# Altium project PCB_15122020_01CA.PrjPcb (part 5 of 7)
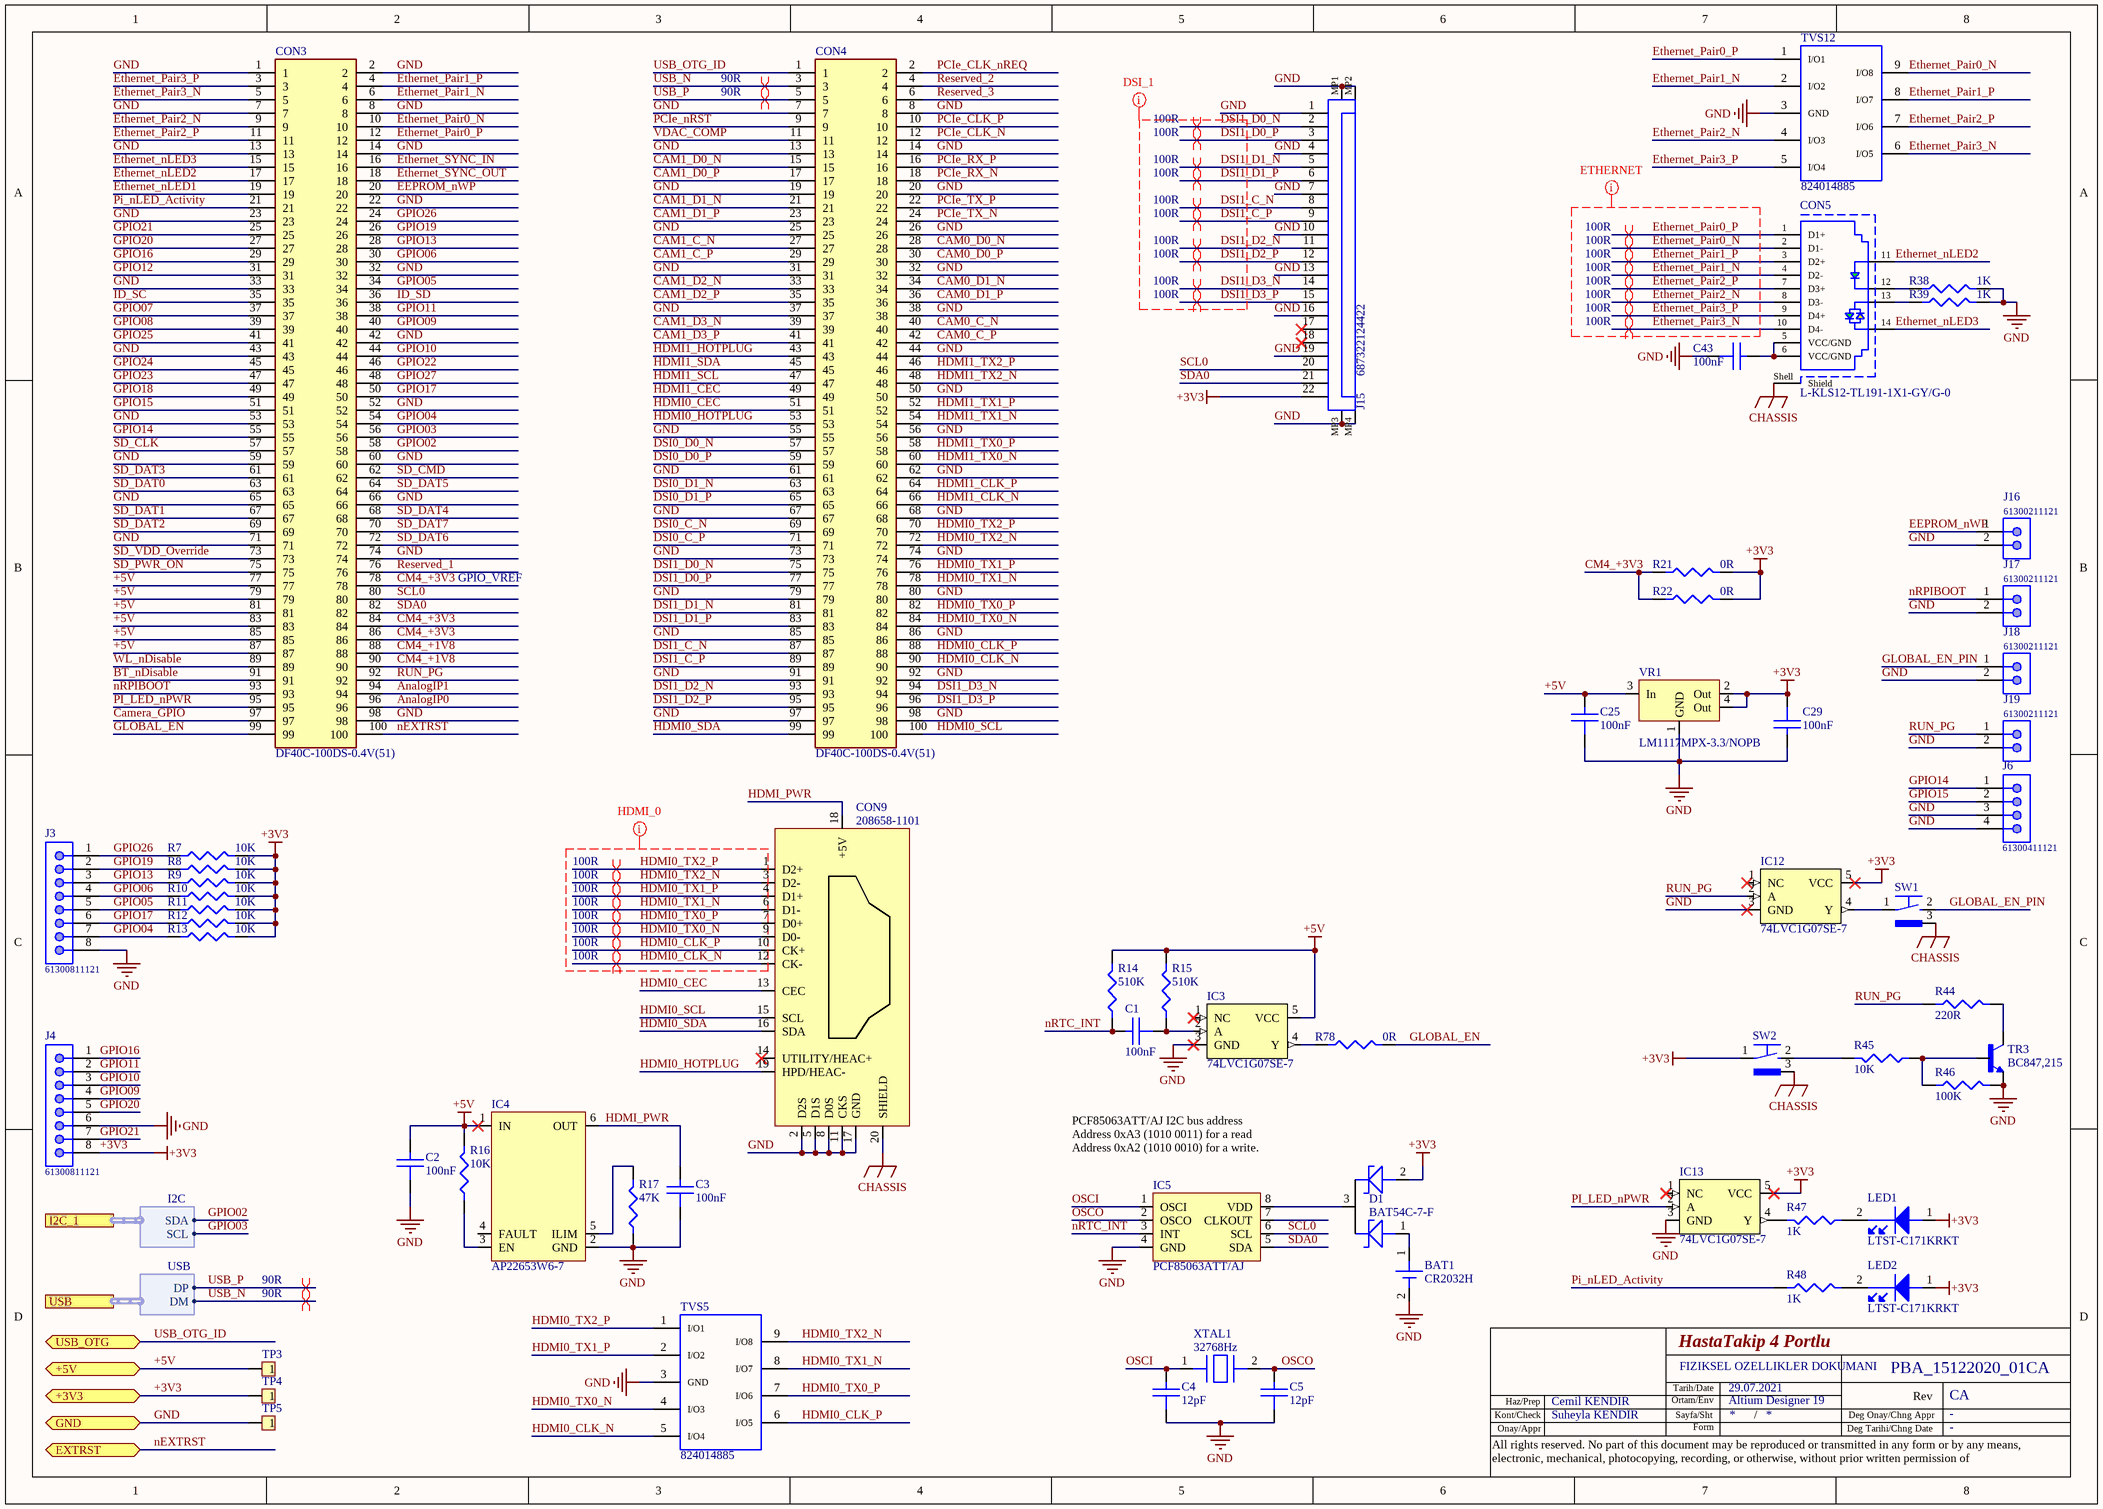
[diagram p9: RaspberyConnector.SchDoc]

## Sheet RaspberyConnector.SchDoc (continued)

### Library data of the parts
BAT1 = CR2032H: CR2032 Yatay Montaj; Category: Battery
C1-C3 C25 C29 C43 = CC0603KRX7R8BB104: 100nF, 25V, X7R, 10%, 0603; Manufacturer: Yageo; Supplier 1: Digi-Key; Supplier Part Number 1: 311-1341-1-ND; Manufacturer Part Number: CC0603KRX7R8BB104; Stock 1: 10150433; Pricing 1: 1 = 0,10000, 10 = 0,04500, 50 = 0,02480, 100 = 0,02020, 500 = 0,01444, 1000 = 0,01134 (USD); RoHS: Yes; Mount: Surface Mount; Case/Package: 0603; Number of Pins: 2; Case Code (Imperial): 0603; Case Code (Metric): 1608; Min Operating Temperature: -55°C; Max Operating Temperature: 125°C; Capacitance: 100nF; Tolerance: 10%; Voltage Rating: 25V; Packaging: Tape and Reel; Package Quantity: 1; Voltage Rating (DC): 25V; Dielectric: X7R; Termination: SMD/SMT; Resistor Type: Ceramic; Voltage: 25V; Length: 1.6mm; Width: 0.8mm; Height: 0.8mm; Thickness: 0.035inch; Depth: 0.8mm; Radiation Hardening: No; REACH SVHC: Unknown; Lead Free: Lead Free; Halogen Free: Halogen Free; ComponentLink1URL: https://datasheet.ciiva.com/11786/0900766b80c10176-11786120.pdf?src-supplier=RSComponents; ComponentLink1Description: https://datasheet.ciiva.com/11786/0900766b80c10176-11786120.pdf?src-supplier=RSComponents; ComponentLink2URL: https://datasheet.ciiva.com/144/mlccorderingcode-144075.pdf?src-supplier=Digi-Key; ComponentLink2Description: https://datasheet.ciiva.com/144/mlccorderingcode-144075.pdf?src-supplier=Digi-Key; ComponentLink3URL: https://datasheet.ciiva.com/17434/upy-gphc-x7r-6-3v-to-50v-8-17434263.pdf?src-supplier=Avnet+Europe; ComponentLink3Description: https://datasheet.ciiva.com/17434/upy-gphc-x7r-6-3v-to-50v-8-17434263.pdf?src-supplier=Avnet+Europe; ComponentLink4URL: https://datasheet.ciiva.com/26829/getdatasheetpartid-403577-26829431.pdf?src-supplier=Verical; ComponentLink4Description: https://datasheet.ciiva.com/26829/getdatasheetpartid-403577-26829431.pdf?src-supplier=Verical; ComponentLink5URL: https://datasheet.ciiva.com/11587/upy-gphc-x7r-6-3v-to-50v-8-11587208.pdf?src-supplier=Avnet; ComponentLink5Description: https://datasheet.ciiva.com/11587/upy-gphc-x7r-6-3v-to-50v-8-11587208.pdf?src-supplier=Avnet; ComponentLink6URL: https://datasheet.ciiva.com/13389/upy-gphc-x7r-6-3v-to-50v-8-13389352.pdf?src-supplier=Mouser; ComponentLink6Description: https://datasheet.ciiva.com/13389/upy-gphc-x7r-6-3v-to-50v-8-13389352.pdf?src-supplier=Mouser; ComponentLink7URL: https://datasheet.ciiva.com/28450/1489800-28450584.pdf?src-supplier=Element14; ComponentLink7Description: https://datasheet.ciiva.com/28450/1489800-28450584.pdf?src-supplier=Element14; ComponentLink8URL: https://datasheet.ciiva.com/144/mlccorderingcode-144073.pdf?src-supplier=Digi-Key; ComponentLink8Description: https://datasheet.ciiva.com/144/mlccorderingcode-144073.pdf?src-supplier=Digi-Key; ComponentLink9URL: https://datasheet.ciiva.com/144/mlccorderingcode-144074.pdf?src-supplier=Digi-Key; ComponentLink9Description: https://datasheet.ciiva.com/144/mlccorderingcode-144074.pdf?src-supplier=Digi-Key; ComponentLink10URL: https://datasheet.ciiva.com/7978/1489800-7978155.pdf?src-supplier=Element14; ComponentLink10Description: https://datasheet.ciiva.com/7978/1489800-7978155.pdf?src-supplier=Element14; Category: Capasitor
C4 C5 = CC0603JRNPO9BN120: 12pF 50V C0G 5% SMD 0603 125C T/R; Manufacturer: Yageo; Dielectric Material: Ceramic; Insulation Resistance: 100GR; Supplier 1: Digi-Key; Supplier Part Number 1: 311-1059-1-ND; Manufacturer Part Number: CC0603JRNPO9BN120; Stock 1: 139479; Pricing 1: 1 = 0,10000, 10 = 0,05600, 50 = 0,03040, 100 = 0,02480, 500 = 0,01774, 1000 = 0,01395 (USD); RoHS: Yes; Mount: Surface Mount; Case/Package: 0603; Number of Pins: 2; Case Code (Metric): 1608; Case Code (Imperial): 0603; Min Operating Temperature: -55°C; Max Operating Temperature: 125°C; Capacitance: 12pF; Tolerance: 5%; Packaging: Tape and Reel; Voltage Rating (DC): 50V; Dielectric: C0G; Package Quantity: 1; Voltage Rating: 50V; Termination: SMD/SMT; Resistor Type: Ceramic; Length: 1.6mm; Width: 0.031inch; Height: 0.8mm; Thickness: 0.035inch; Depth: 0.8mm; Radiation Hardening: No; REACH SVHC: No SVHC; Lead Free: Lead Free; ComponentLink1URL: https://datasheet.ciiva.com/144/mlccorderingcode-144448.pdf?src-supplier=Digi-Key; ComponentLink1Description: https://datasheet.ciiva.com/144/mlccorderingcode-144448.pdf?src-supplier=Digi-Key; ComponentLink2URL: https://datasheet.ciiva.com/144/mlccorderingcode-144449.pdf?src-supplier=Digi-Key; ComponentLink2Description: https://datasheet.ciiva.com/144/mlccorderingcode-144449.pdf?src-supplier=Digi-Key; ComponentLink3URL: https://datasheet.ciiva.com/144/mlccorderingcode-144450.pdf?src-supplier=Digi-Key; ComponentLink3Description: https://datasheet.ciiva.com/144/mlccorderingcode-144450.pdf?src-supplier=Digi-Key; ComponentLink4URL: https://datasheet.ciiva.com/8033/1734582-8033717.pdf?src-supplier=Element14; ComponentLink4Description: https://datasheet.ciiva.com/8033/1734582-8033717.pdf?src-supplier=Element14; ComponentLink5URL: https://datasheet.ciiva.com/5425/upy-gp-np0-16v-to-50v-8-5425478.pdf?src-supplier=Mouser; ComponentLink5Description: https://datasheet.ciiva.com/5425/upy-gp-np0-16v-to-50v-8-5425478.pdf?src-supplier=Mouser; ComponentLink6URL: https://datasheet.ciiva.com/8033/1734582-8033718.pdf?src-supplier=Element14; ComponentLink6Description: https://datasheet.ciiva.com/8033/1734582-8033718.pdf?src-supplier=Element14; ComponentLink7URL: https://datasheet.ciiva.com/11464/upy-gp-np0-16v-to-50v-8-11464726.pdf?src-supplier=Avnet; ComponentLink7Description: https://datasheet.ciiva.com/11464/upy-gp-np0-16v-to-50v-8-11464726.pdf?src-supplier=Avnet; ComponentLink8URL: https://datasheet.ciiva.com/28450/1443161-28450470.pdf?src-supplier=Element14; ComponentLink8Description: https://datasheet.ciiva.com/28450/1443161-28450470.pdf?src-supplier=Element14; ComponentLink9URL: https://datasheet.ciiva.com/16625/upy-gp-np0-16v-to-50v-8-16625516.pdf?src-supplier=Avnet+Europe; ComponentLink9Description: https://datasheet.ciiva.com/16625/upy-gp-np0-16v-to-50v-8-16625516.pdf?src-supplier=Avnet+Europe; Category: Capasitor
CON3 CON4 = DF40C-100DS-0.4V(51): Manufacturer: Hirose; Connector Type: Receptacle; Number of Positions: 100; Max Voltage Rating (AC): 30V; Contact Resistance: 90mR; Max Current Rating: 300mA; Pitch: 0.4mm; Mated Stacking Heights: 1.5mm; Supplier 1: Digi-Key; Manufacturer Part Number: DF40C-100DS-0.4V(51); Stock 1: 4110; Pricing 1: 1 = 1,73000, 10 = 1,56800, 25 = 1,47200, 50 = 1,40800, 100 = 1,34400, 250 = 1,21600, 500 = 1,12000, 1000 = 0,96000, 2500 = 0,89600 (USD); RoHS: Yes; Mount: Surface Mount; Housing Material: Polymer; Housing Color: Black; Contact Material: Bronze; Contact Plating: Gold; Min Operating Temperature: -35°C; Max Operating Temperature: 85°C; Orientation: Straight; Termination: SMD/SMT; Number of Contacts: 100; Gender: Receptacle; Number of Rows: 2; Packaging: Tape and Reel; Package Quantity: 1; Voltage Rating: 30V; Current Rating: 300mA; Length: 22.6mm; Depth: 3.38mm; Radiation Hardening: No; Lead Free: Lead Free; REACH SVHC: Unknown; ComponentLink1URL: https://datasheet.ciiva.com/26948/getdatasheetpartid-441624-26948933.pdf?src-supplier=Verical; ComponentLink1Description: https://datasheet.ciiva.com/26948/getdatasheetpartid-441624-26948933.pdf?src-supplier=Verical; ComponentLink2URL: https://datasheet.ciiva.com/46408/1824826-46408894.pdf?src-supplier=Element14; ComponentLink2Description: https://datasheet.ciiva.com/46408/1824826-46408894.pdf?src-supplier=Element14; Supplier Part Number 1: H11615CT-ND; Category: Connectors, Interconnects Rectangular Connectors - Arrays, Edge Type, Mezzanine (Board to Board)
CON5 = L-KLS12-TL191-1X1-GY/G-0: MODULAR JACK THT R/A 8P8C (RJ45,Ethernet) GRAY; Manufacturer: KLS ELECTRONIC; Category: Connectors, Interconnects Modular Connectors - Jacks With Magnetics; Manufacturer Part Number: L-KLS12-TL191-1X1-GY/G-0; Supplier 1: Özdisan; Supplier Part Number 1: L-KLS12-TL191-1X1-GY/G-0; ComponentLink1Description: Ozdisan; ComponentLink1URL: https://cdn.ozdisan.com/ETicaret_Dosya/528004_2611611.PDF
CON9 = 208658-1101: HDMI; 0.5mm; v2.1; RT Angle; w/o Mylar; w/o Flange; 19 Circuits; Manufacturer: Molex; Supplier 1: Digi-Key; Supplier Part Number 1: 900-2086581101CT-ND; Manufacturer Part Number: 208658-1101; Stock 1: 1640; Pricing 1: 1 = 2,36000, 10 = 2,01000, 100 = 1,66040 (USD); RoHS: No; Category: Connectors, Interconnects HDMI Connectors
D1 = BAT54C-7-F: Diodes Inc BAT54C-7-F, Dual SMT Schottky Switching Diode, Common Cathode, 30V 200mA, 5ns, 3-Pin SOT-23; Power Rating: 200mW; Capacitance: 10pF; Forward Voltage: 800mV; Max Reverse Current: 2uA; Peak Non-Repetitive Surge Current: 600mA; Supplier 1: Digi-Key; Supplier Part Number 1: BAT54C-FDICT-ND; Manufacturer: Diodes; Manufacturer Part Number: BAT54C-7-F; Stock 1: 151567; Pricing 1: 1 = 0,18000, 10 = 0,13000, 100 = 0,07040, 500 = 0,05530, 1000 = 0,03840 (USD); RoHS: Yes; Mount: Surface Mount; Case/Package: SOT-23; Number of Pins: 3; Contact Plating: Tin,Matte; Weight: 0.000282oz; Min Operating Temperature: -65°C; Max Operating Temperature: 150°C; Current Rating: 200mA; Voltage Rating (DC): 30V; Package Quantity: 3000; Element Configuration: Common Cathode; Packaging: Tape and Reel; Forward Current: 200mA; Average Rectified Current: 200mA; Reverse Recovery Time: 5ns; Max Repetitive Reverse Voltage (Vrrm): 30V; Max Forward Surge Current (Ifsm): 600mA; Max Power Dissipation: 200mW; Power Dissipation: 200mW; Termination: SMD/SMT; Max Reverse Voltage (DC): 30V; Length: 2.9mm; Width: 1.3mm; Height: 1mm; Radiation Hardening: No; Lead Free: Lead Free; REACH SVHC: No SVHC; ComponentLink1URL: https://datasheet.ciiva.com/904/ds11005-904592.pdf?src-supplier=Digi-Key; ComponentLink1Description: https://datasheet.ciiva.com/904/ds11005-904592.pdf?src-supplier=Digi-Key; ComponentLink2URL: https://datasheet.ciiva.com/15143/getdatasheetpartid-29884-15143959.pdf?src-supplier=Verical; ComponentLink2Description: https://datasheet.ciiva.com/15143/getdatasheetpartid-29884-15143959.pdf?src-supplier=Verical; ComponentLink3URL: https://datasheet.ciiva.com/22695/1911820-22695254.pdf?src-supplier=Element14; ComponentLink3Description: https://datasheet.ciiva.com/22695/1911820-22695254.pdf?src-supplier=Element14; Category: Diode
IC3 IC12 IC13 = 74LVC1G07SE-7: Buffer/Driver 1-CH Non-Inverting Open Drain CMOS 5-Pin SOT-353 T/R; Manufacturer: Diodes; Number of Gates: 1; Max Supply Voltage: 5.5V; Min Supply Voltage: 1.65V; Propagation Delay: 8.5ns; Logic Function: Buffer,Inverting; Polarity: Inverting,Non-Inverting; Low Level Output Current: 32mA; Operating Supply Current: 10uA; Quiescent Current: 200uA; Supplier 1: Digi-Key; Supplier Part Number 1: 74LVC1G07SE-7DICT-ND; Manufacturer Part Number: 74LVC1G07SE-7; Stock 1: 16164; Pricing 1: 1 = 0,26000, 10 = 0,21500, 25 = 0,18000, 100 = 0,11400, 250 = 0,08800, 500 = 0,07500, 1000 = 0,05100 (USD); RoHS: Yes; Mount: Surface Mount; Case/Package: SOT-353; Number of Pins: 5; Min Operating Temperature: -40°C; Max Operating Temperature: 85°C; Number of Inputs: 1; Packaging: Tape and Reel; Package Quantity: 3000; Number of Elements: 1; Number of Channels: 1; Number of Outputs: 1; Number of Input Lines: 1; Number of Output Lines: 1; Number of Bits per Element: 1; Turn-On Delay Time: 8.5ns; Length: 2.2mm; Width: 1.35mm; Height: 1mm; Radiation Hardening: No; REACH SVHC: No SVHC; Lead Free: Lead Free; ComponentLink1URL: https://datasheet.ciiva.com/8260/74lvc1g07-8260976.pdf?src-supplier=Avnet; ComponentLink1Description: https://datasheet.ciiva.com/8260/74lvc1g07-8260976.pdf?src-supplier=Avnet; ComponentLink2URL: https://datasheet.ciiva.com/26856/getdatasheetpartid-302086-26856250.pdf?src-supplier=Verical; ComponentLink2Description: https://datasheet.ciiva.com/26856/getdatasheetpartid-302086-26856250.pdf?src-supplier=Verical; ComponentLink3URL: https://datasheet.ciiva.com/1832/74lvc1g07-1832566.pdf?src-supplier=Digi-Key; ComponentLink3Description: https://datasheet.ciiva.com/1832/74lvc1g07-1832566.pdf?src-supplier=Digi-Key; ComponentLink4URL: https://datasheet.ciiva.com/1832/74lvc1g07-1832567.pdf?src-supplier=Digi-Key; ComponentLink4Description: https://datasheet.ciiva.com/1832/74lvc1g07-1832567.pdf?src-supplier=Digi-Key; ComponentLink5URL: https://datasheet.ciiva.com/1832/74lvc1g07-1832568.pdf?src-supplier=Digi-Key; ComponentLink5Description: https://datasheet.ciiva.com/1832/74lvc1g07-1832568.pdf?src-supplier=Digi-Key; ComponentLink6URL: https://datasheet.ciiva.com/1506/74lvc1g07-1506202.pdf?src-supplier=Element14; ComponentLink6Description: https://datasheet.ciiva.com/1506/74lvc1g07-1506202.pdf?src-supplier=Element14; ComponentLink7URL: https://datasheet.ciiva.com/17291/74lvc1g07-17291948.pdf?src-supplier=Avnet+Europe; ComponentLink7Description: https://datasheet.ciiva.com/17291/74lvc1g07-17291948.pdf?src-supplier=Avnet+Europe; ComponentLink8URL: https://datasheet.ciiva.com/8305/74lvc1g07-8305775.pdf?src-supplier=Avnet; ComponentLink8Description: https://datasheet.ciiva.com/8305/74lvc1g07-8305775.pdf?src-supplier=Avnet; Category: Integrated Circuits (ICs) Logic - Buffers, Drivers, Receivers, Transceivers
IC4 = AP22653W6-7: Power Switch/Driver 1:1 P-Channel 2.1A SOT-23-6; Manufacturer: Diodes; Supplier 1: Digi-Key; Manufacturer Part Number: AP22653W6-7; Stock 1: 12659; Pricing 1: 1 = 0,42000, 10 = 0,35600, 25 = 0,33200, 100 = 0,24670, 250 = 0,20880, 500 = 0,19930, 1000 = 0,14710 (USD); RoHS: No; Supplier Part Number 1: 31-AP22653W6-7CT-ND; Category: Integrated Circuits - PMIC - Power Distribution Switches, Load Drivers
IC5 = PCF85063ATT/AJ: Real time clock, TSSOP-8,; Manufacturer: NXP Semiconductors; Interface: I2C,Serial,2-Wire; Max Supply Voltage: 5.5V; Min Supply Voltage: 900mV; Time Format: HH:MM:SS (12/24 hr); Date Format: YY-MM-DD-dd; Supplier 1: Digi-Key; Supplier Part Number 1: 568-12404-1-ND; Manufacturer Part Number: PCF85063ATT/AJ; Stock 1: 34322; Pricing 1: 1 = 0,83000, 10 = 0,73300, 25 = 0,68880, 100 = 0,56220, 250 = 0,52216, 500 = 0,44440, 1000 = 0,35552 (USD); RoHS: Yes; Mount: Surface Mount; Case/Package: TSSOP; Number of Pins: 8; Contact Plating: Gold; Min Operating Temperature: -40°C; Max Operating Temperature: 85°C; Packaging: Tape and Reel; Logic Function: Clock; Lead Free: Lead Free; ComponentLink1URL: http://www.farnell.com/datasheets/2014362.pdf?src-supplier=Farnell; ComponentLink1Description: http://www.farnell.com/datasheets/2014362.pdf?src-supplier=Farnell; ComponentLink2URL: https://www.nxp.com/docs/en/data-sheet/PCF85063A.pdf?src-supplier=Digi-Key; ComponentLink2Description: https://www.nxp.com/docs/en/data-sheet/PCF85063A.pdf?src-supplier=Digi-Key; ComponentLink3URL: http://www.nxp.com/documents/data_sheet/PCF85063A.pdf?src-supplier=Avnet+Asia; ComponentLink3Description: http://www.nxp.com/documents/data_sheet/PCF85063A.pdf?src-supplier=Avnet+Asia; ComponentLink4URL: http://www.nxp.com/documents/data_sheet/PCF85063A.pdf?src-supplier=Avnet; ComponentLink4Description: http://www.nxp.com/documents/data_sheet/PCF85063A.pdf?src-supplier=Avnet; Category: Integrated Circuits (ICs) Clock/Timing - Real Time Clocks
J3 J4 = 61300811121: WR-PHD Pin Header, THT, pitch 2.54mm, Single Row, Vertical, 8pin; Manufacturer: Wurth Electronics; Pin Number: 8; Gender: Male; Rated Current: 3A; Working Voltage: 250VAC; Withstanding Voltage: 500VAC; Contact Resistance: 20mOhm; Connector Type: Male Pin; ComponentLink1Description: Manufacturer; ComponentLink1URL: http://www.we-online.de; ComponentLink2Description: Datasheet; ComponentLink2URL: https://katalog.we-online.de/em/datasheet/6130xx11121.pdf; Part Number: 61300811121; Published Date: June 2019; Publisher: Wurth Elektronik; Pitch: 2.54mm; Operating Temperature: -40 to +105degC; Mounting Technology: THT; Packaging: Bag; Row Number: Single; Orientation: Vertical; Supplier 1: Digi-Key; Manufacturer Part Number: 61300811121; Stock 1: 15970; Pricing 1: 1 = 0,37000, 10 = 0,31500, 25 = 0,26320, 50 = 0,21900, 100 = 0,19900, 1000 = 0,18100 (USD); RoHS: Yes; Mount: Through Hole; Contact Plating: Gold; Contact Material: Copper; Color: Black; Number of Rows: 1; Number of Positions: 8; Termination: Solder; Number of Contacts: 8; Contact Mating Length: 0.236inch; REACH SVHC: Unknown; ComponentLink3URL: http://www.farnell.com/cad/1737268.pdf?src-supplier=Element14; ComponentLink3Description: http://www.farnell.com/cad/1737268.pdf?src-supplier=Element14; ComponentLink4URL: https://katalog.we-online.de/em/datasheet/6130xx11121.pdf?src-supplier=Digi-Key; ComponentLink4Description: https://katalog.we-online.de/em/datasheet/6130xx11121.pdf?src-supplier=Digi-Key; Category: Connectors, Interconnects Rectangular Connectors; Supplier Part Number 1: 732-5321-ND
J6 = 61300411121: WR-PHD Pin Header, THT, pitch 2.54mm, Single Row, Vertical, 4pin; Manufacturer: Wurth Electronics; Pin Number: 4; Gender: Male; Rated Current: 3A; Working Voltage: 250VAC; Withstanding Voltage: 500VAC; Contact Resistance: 20mOhm; Connector Type: Male Pin; ComponentLink1Description: Manufacturer; ComponentLink1URL: http://www.we-online.de; ComponentLink2Description: Datasheet; ComponentLink2URL: https://katalog.we-online.de/em/datasheet/6130xx11121.pdf; Part Number: 61300411121; Published Date: June 2019; Publisher: Wurth Elektronik; Pitch: 2.54mm; Operating Temperature: -40 to +105degC; Mounting Technology: THT; Packaging: Bag; Row Number: Single; Orientation: Vertical; Supplier 1: Mouser; Manufacturer Part Number: 61300411121; Stock 1: 12652; Pricing 1: 1 = 0,18000, 10 = 0,15300, 25 = 0,12700, 50 = 0,10600, 100 = 0,09600, 250 = 0,09600 (USD); RoHS: Yes; Mount: Through Hole; Contact Plating: Gold; Contact Material: Copper; Color: Black; Number of Rows: 1; Number of Positions: 4; Termination: Solder; Number of Contacts: 4; Contact Mating Length: 0.236inch; REACH SVHC: Unknown; Lead Free: Lead Free; ComponentLink3URL: http://www.farnell.com/cad/1737268.pdf?src-supplier=Element14; ComponentLink3Description: http://www.farnell.com/cad/1737268.pdf?src-supplier=Element14; ComponentLink4URL: https://katalog.we-online.de/em/datasheet/6130xx11121.pdf?src-supplier=Digi-Key; ComponentLink4Description: https://katalog.we-online.de/em/datasheet/6130xx11121.pdf?src-supplier=Digi-Key; Category: Connectors, Interconnects Rectangular Connectors; Supplier Part Number 1: 710-61300411121
J15 = 687322124422: WR-FPC SMT ZIF Vertical, pitch 0.5mm, 22p; Manufacturer: Wurth Elektronik; Contact Resistance: 20mOhm; Pin Number: 22; Working Voltage: 50VAC; Rated Current: 0.5A; ComponentLink1Description: Manufacturer; ComponentLink1URL: http://www.we-online.de; ComponentLink2Description: Datasheet; ComponentLink2URL: https://katalog.we-online.com/em/datasheet/687322124422.pdf; Packaging: Tape and Reel; Pitch: 0.5mm; Published Date: November 2019; Mounting Technology: SMT; Operating Temperature: -25 to +85degC; Length: 17.4mm; Part Number: 687322124422; Type: Vertical; Publisher: Wurth Elektronik; Category: WR-FPC SMT ZIF Vertical, pitch 0.5mm, 22p
J16-J19 = 61300211121: WR-PHD Pin Header, THT, pitch 2.54mm, Single Row, Vertical, 2pin; Manufacturer: Wurth Electronics; Pin Number: 2; Gender: Male; Rated Current: 3A; Working Voltage: 250VAC; Withstanding Voltage: 500VAC; Contact Resistance: 20mOhm; Voltage Rating: 250V; Connector Type: Male Pin; ComponentLink1Description: Manufacturer; ComponentLink1URL: http://www.we-online.de; ComponentLink2Description: Datasheet; ComponentLink2URL: https://katalog.we-online.de/em/datasheet/6130xx11121.pdf; Part Number: 61300211121; Published Date: June 2019; Publisher: Wurth Elektronik; Pitch: 2.54mm; Operating Temperature: -40 to +105degC; Mounting Technology: THT; Packaging: Bag; Row Number: Single; Orientation: Vertical; Supplier 1: Digi-Key; Manufacturer Part Number: 61300211121; Stock 1: 150487; Pricing 1: 1 = 0,13000, 10 = 0,10600, 25 = 0,08800, 50 = 0,07400, 100 = 0,06700, 1000 = 0,06100 (USD); RoHS: Yes; Mount: Through Hole; Contact Plating: Gold; Housing Material: PBT; Contact Material: Copper Alloy,Copper; Color: Black; Min Operating Temperature: -40°C; Max Operating Temperature: 125°C; Number of Rows: 1; Contact Gender: Male; Current Rating: 3A; Number of Positions: 2; Termination: Through Hole; Number of Contacts: 2; Contact Mating Length: 0.236inch; REACH SVHC: Unknown; Lead Free: Lead Free; ComponentLink3URL: https://datasheet.ciiva.com/13619/6130xx11121-48870-13619345.pdf?src-supplier=Mouser; ComponentLink3Description: https://datasheet.ciiva.com/13619/6130xx11121-48870-13619345.pdf?src-supplier=Mouser; Category: Connectors, Interconnects Rectangular Connectors; Supplier Part Number 1: 732-5315-ND
LED1 LED2 = LTST-C171KRKT: LED RED CLEAR SMD; Manufacturer: Vishay Lite-On; Lens Color: Colorless; Viewing Angle: 130°; Lens Style: Diffused; Forward Current: 30mA; Forward Voltage: 2V; Power Rating: 75mW; Luminous Intensity: 54mcd; Test Current: 20mA; Dominant Wavelength: 631nm; Number of Elements: 1; Wavelength: 639nm; Reverse Voltage: 5V; Supplier 1: Digi-Key; Supplier Part Number 1: 160-1427-1-ND; Manufacturer Part Number: LTST-C171KRKT; RoHS: Yes; Stock 1: 137075; Pricing 1: 1 = 0,31000, 10 = 0,22500, 25 = 0,16560, 100 = 0,11830, 250 = 0,08040, 500 = 0,07096, 1000 = 0,05558 (USD); Mount: Surface Mount; Case/Package: 0805; Number of Pins: 2; Color: Red; Case Code (Metric): 2012; Case Code (Imperial): 0805; Min Operating Temperature: -55°C; Max Operating Temperature: 85°C; Package Quantity: 3000; Packaging: Tape and Reel; Illumination Color: Red; Lens Transparency: Clear; Power Dissipation: 75mW; Number of LEDs: 1; Length: 2mm; Height: 0.8mm; Width: 1.25mm; Depth: 1.25mm; Radiation Hardening: No; Lead Free: Lead Free; ComponentLink1URL: https://datasheet.ciiva.com/12403/lite-on-ltst-c171krkt-187201-12403781.pdf?src-supplier=Mouser; ComponentLink1Description: https://datasheet.ciiva.com/12403/lite-on-ltst-c171krkt-187201-12403781.pdf?src-supplier=Mouser; ComponentLink2URL: https://datasheet.ciiva.com/11775/0900766b80dc0299-11775643.pdf?src-supplier=RSComponents; ComponentLink2Description: https://datasheet.ciiva.com/11775/0900766b80dc0299-11775643.pdf?src-supplier=RSComponents; ComponentLink3URL: https://datasheet.ciiva.com/16444/lite-on20ltst-c171krkt-16444779.pdf?src-supplier=Future+Electronics; ComponentLink3Description: https://datasheet.ciiva.com/16444/lite-on20ltst-c171krkt-16444779.pdf?src-supplier=Future+Electronics; ComponentLink4URL: https://datasheet.ciiva.com/2110/s-110-ltst-c171krkt-2110066.pdf?src-supplier=Digi-Key; ComponentLink4Description: https://datasheet.ciiva.com/2110/s-110-ltst-c171krkt-2110066.pdf?src-supplier=Digi-Key; ComponentLink5URL: https://datasheet.ciiva.com/2110/s-110-ltst-c171krkt-2110067.pdf?src-supplier=Digi-Key; ComponentLink5Description: https://datasheet.ciiva.com/2110/s-110-ltst-c171krkt-2110067.pdf?src-supplier=Digi-Key; ComponentLink6URL: https://datasheet.ciiva.com/2110/s-110-ltst-c171krkt-2110068.pdf?src-supplier=Digi-Key; ComponentLink6Description: https://datasheet.ciiva.com/2110/s-110-ltst-c171krkt-2110068.pdf?src-supplier=Digi-Key; Category: LED Indication
R7-R13 R16 R45 = RT0603FRE0710KL: 10K OHM 1% 1/10W 0603; Manufacturer: Yageo; Resistance: 10kR; Power Rating: 100mW; Voltage Rating: 75V; Temperature Coefficient: 50ppm/°C; Supplier 1: Digi-Key; Supplier Part Number 1: YAG2321CT-ND; Manufacturer Part Number: RT0603FRE0710KL; Stock 1: 326134; Pricing 1: 1 = 0,10000, 10 = 0,05600, 100 = 0,02270, 1000 = 0,01020, 2500 = 0,00886 (USD); RoHS: Yes; Case/Package: 0603; Number of Pins: 2; Case Code (Metric): 1608; Case Code (Imperial): 0603; Contact Plating: Tin,Lead; Min Operating Temperature: -55°C; Max Operating Temperature: 125°C; Package Quantity: 5000; Packaging: Tape and Reel; Tolerance: 1%; Resistor Type: Thin Film; Number of Terminations: 2; Termination: SMD/SMT; Max Power Dissipation: 100mW; Voltage Rating (DC): 75V; Features: Moisture Resistant; Length: 0.063inch; Width: 0.031inch; Height: 0.022inch; Depth: 0.8mm; REACH SVHC: Unknown; Military Standard: Not; Lead Free: Lead Free; ComponentLink1URL: https://datasheet.ciiva.com/2559/pyu-rt-1-to-0-05-rohs-l-5-2559482.pdf?src-supplier=Digi-Key; ComponentLink1Description: https://datasheet.ciiva.com/2559/pyu-rt-1-to-0-05-rohs-l-5-2559482.pdf?src-supplier=Digi-Key; ComponentLink2URL: https://datasheet.ciiva.com/16745/pyu-rt-1-to-0-05-rohs-l-4-16745739.pdf?src-supplier=Future+Electronics; ComponentLink2Description: https://datasheet.ciiva.com/16745/pyu-rt-1-to-0-05-rohs-l-4-16745739.pdf?src-supplier=Future+Electronics; ComponentLink3URL: https://datasheet.ciiva.com/12694/pyu-rt-1-to-0-05-rohs-l-4-12694910.pdf?src-supplier=Mouser; ComponentLink3Description: https://datasheet.ciiva.com/12694/pyu-rt-1-to-0-05-rohs-l-4-12694910.pdf?src-supplier=Mouser; Category: Resistor
R14 R15 = RC0603FR-07510KL: 510K, 1%, 1/10W, 0603; Manufacturer: Yageo; Power Rating: 100mW; Resistance: 510kR; Voltage Rating: 50V; Temperature Coefficient: 100ppm/°C; Supplier 1: Digi-Key; Supplier Part Number 1: 311-510KHRCT-ND; Manufacturer Part Number: RC0603FR-07510KL; Stock 1: 184765; Pricing 1: 1 = 0,10000, 10 = 0,02100, 100 = 0,00840, 1000 = 0,00379, 2500 = 0,00329 (USD); RoHS: Yes; Case/Package: 0603; Case Code (Imperial): 0603; Case Code (Metric): 1608; Min Operating Temperature: -55°C; Max Operating Temperature: 155°C; Tolerance: 1%; Packaging: Tape and Reel; Package Quantity: 1; Termination: SMD/SMT; Resistor Type: Thick Film; Number of Terminations: 2; Max Power Dissipation: 100mW; Voltage Rating (DC): 50V; Features: Moisture Resistant; Length: 1.6mm; Width: 0.8mm; Height: 0.022inch; Depth: 0.8mm; Lead Free: Lead Free; Military Standard: Not; ComponentLink1URL: https://datasheet.ciiva.com/12555/rc0603-272842-12555383.pdf?src-supplier=Mouser; ComponentLink1Description: https://datasheet.ciiva.com/12555/rc0603-272842-12555383.pdf?src-supplier=Mouser; ComponentLink2URL: https://datasheet.ciiva.com/2454/pyu-r-int-thick-7-2454984.pdf?src-supplier=Digi-Key; ComponentLink2Description: https://datasheet.ciiva.com/2454/pyu-r-int-thick-7-2454984.pdf?src-supplier=Digi-Key; ComponentLink3URL: https://datasheet.ciiva.com/2454/pyu-r-int-thick-7-2454985.pdf?src-supplier=Digi-Key; ComponentLink3Description: https://datasheet.ciiva.com/2454/pyu-r-int-thick-7-2454985.pdf?src-supplier=Digi-Key; ComponentLink4URL: https://datasheet.ciiva.com/2454/pyu-r-int-thick-7-2454986.pdf?src-supplier=Digi-Key; ComponentLink4Description: https://datasheet.ciiva.com/2454/pyu-r-int-thick-7-2454986.pdf?src-supplier=Digi-Key; Category: Resistor
R17 = RC0603FR-0747KL: 47K, 50V, 1/10W, 1%, 0603; Manufacturer: Yageo; Resistance: 47kR; Temperature Coefficient: 100ppm/°C; Power Rating: 100mW; Supplier 1: Digi-Key; Supplier Part Number 1: 311-47.0KHRCT-ND; Manufacturer Part Number: RC0603FR-0747KL; Stock 1: 4802381; Pricing 1: 1 = 0,10000, 10 = 0,02100, 100 = 0,00840, 1000 = 0,00379, 2500 = 0,00329 (USD); RoHS: Yes; Case/Package: 0603; Number of Pins: 2; Case Code (Metric): 1608; Case Code (Imperial): 0603; Min Operating Temperature: -55°C; Max Operating Temperature: 155°C; Tolerance: 1%; Packaging: Tape and Reel; Voltage Rating (DC): 50V; Resistor Type: Thick Film; Voltage Rating: 50V; Termination: SMD/SMT; Package Quantity: 1; Number of Terminations: 2; Max Power Dissipation: 100mW; Features: Moisture Resistant; Length: 1.6mm; Width: 0.031inch; Height: 0.022inch; Depth: 0.8mm; REACH SVHC: Unknown; Lead Free: Lead Free; Military Standard: Not; ComponentLink1URL: https://datasheet.ciiva.com/11808/0900766b80f96399-11808118.pdf?src-supplier=RSComponents; ComponentLink1Description: https://datasheet.ciiva.com/11808/0900766b80f96399-11808118.pdf?src-supplier=RSComponents; ComponentLink2URL: https://datasheet.ciiva.com/7746/443971-7746361.pdf?src-supplier=Element14; ComponentLink2Description: https://datasheet.ciiva.com/7746/443971-7746361.pdf?src-supplier=Element14; ComponentLink3URL: https://datasheet.ciiva.com/7746/443971-7746362.pdf?src-supplier=Element14; ComponentLink3Description: https://datasheet.ciiva.com/7746/443971-7746362.pdf?src-supplier=Element14; ComponentLink4URL: https://datasheet.ciiva.com/2453/pyu-r-int-thick-7-2453931.pdf?src-supplier=Digi-Key; ComponentLink4Description: https://datasheet.ciiva.com/2453/pyu-r-int-thick-7-2453931.pdf?src-supplier=Digi-Key; ComponentLink5URL: https://datasheet.ciiva.com/2453/pyu-r-int-thick-7-2453932.pdf?src-supplier=Digi-Key; ComponentLink5Description: https://datasheet.ciiva.com/2453/pyu-r-int-thick-7-2453932.pdf?src-supplier=Digi-Key; ComponentLink6URL: https://datasheet.ciiva.com/2453/pyu-r-int-thick-7-2453933.pdf?src-supplier=Digi-Key; ComponentLink6Description: https://datasheet.ciiva.com/2453/pyu-r-int-thick-7-2453933.pdf?src-supplier=Digi-Key; Category: Resistor
R21 R22 R78 = RC0603FR-070RL: 0R ,%1 ,1/10 W ,0603; Manufacturer: Yageo; Resistance: 0mR; Power Rating: 100mW; Tolerance: 1%; Voltage Rating: 50V; Temperature Coefficient: 200ppm/°C; Current Rating: 1A; Working Voltage: 75V; Supplier 1: Digi-Key; Supplier Part Number 1: 311-0.0HRCT-ND; Manufacturer Part Number: RC0603FR-070RL; Stock 1: 513794; Pricing 1: 1 = 0,10000, 10 = 0,01800, 25 = 0,01280, 50 = 0,00980, 100 = 0,00730, 250 = 0,00552, 500 = 0,00442, 1000 = 0,00326 (USD); RoHS: Yes; Case/Package: 0603; Number of Pins: 2; Case Code (Metric): 1608; Case Code (Imperial): 0603; Contact Plating: Tin,Matte; Min Operating Temperature: -55°C; Max Operating Temperature: 155°C; Packaging: Tape and Reel; Package Quantity: 5000; Resistor Type: Thick Film; Number of Terminations: 2; Termination: SMD/SMT; Max Power Dissipation: 100mW; Voltage Rating (DC): 50V; Features: Moisture Resistant; Length: 1.6mm; Width: 0.031inch; Height: 0.45mm; Depth: 0.8mm; Radiation Hardening: No; REACH SVHC: No SVHC; Military Standard: Not; Lead Free: Lead Free; ComponentLink1URL: https://datasheet.ciiva.com/11808/0900766b80f96399-11808172.pdf?src-supplier=RSComponents; ComponentLink1Description: https://datasheet.ciiva.com/11808/0900766b80f96399-11808172.pdf?src-supplier=RSComponents; ComponentLink2URL: https://datasheet.ciiva.com/5558/rc0603-272842-5558341.pdf?src-supplier=Mouser; ComponentLink2Description: https://datasheet.ciiva.com/5558/rc0603-272842-5558341.pdf?src-supplier=Mouser; ComponentLink3URL: https://datasheet.ciiva.com/46382/443971-46382072.pdf?src-supplier=Element14; ComponentLink3Description: https://datasheet.ciiva.com/46382/443971-46382072.pdf?src-supplier=Element14; ComponentLink4URL: https://datasheet.ciiva.com/29721/pyu-r-int-thick-7-29721178.pdf?src-supplier=Digi-Key; ComponentLink4Description: https://datasheet.ciiva.com/29721/pyu-r-int-thick-7-29721178.pdf?src-supplier=Digi-Key; ComponentLink5URL: https://datasheet.ciiva.com/5684/443971-5684699.pdf?src-supplier=Farnell; ComponentLink5Description: https://datasheet.ciiva.com/5684/443971-5684699.pdf?src-supplier=Farnell; ComponentLink6URL: https://datasheet.ciiva.com/7983/443971-7983627.pdf?src-supplier=Element14; ComponentLink6Description: https://datasheet.ciiva.com/7983/443971-7983627.pdf?src-supplier=Element14; ComponentLink7URL: https://datasheet.ciiva.com/29721/pyu-rc0603-51-rohs-l-4-29721179.pdf?src-supplier=Digi-Key; ComponentLink7Description: https://datasheet.ciiva.com/29721/pyu-rc0603-51-rohs-l-4-29721179.pdf?src-supplier=Digi-Key; ComponentLink8URL: https://datasheet.ciiva.com/22643/1868787-22643388.pdf?src-supplier=Element14; ComponentLink8Description: https://datasheet.ciiva.com/22643/1868787-22643388.pdf?src-supplier=Element14; Category: Resistor
R38 R39 R47 R48 = RC0603FR-071KL: 1K ,%1 ,1/10 W ,0603; Manufacturer: Yageo; Tolerance: 1%; Resistance: 1kR; Temperature Coefficient: 100ppm/°C; Power Rating: 100mW; Voltage Rating: 50V; Supplier 1: Digi-Key; Supplier Part Number 1: 311-1.00KHRCT-ND; Manufacturer Part Number: RC0603FR-071KL; Stock 1: 29851447; Pricing 1: 1 = 0,10000, 10 = 0,02100, 100 = 0,00840, 1000 = 0,00379, 2500 = 0,00329 (USD); RoHS: Yes; Case/Package: 0603; Contact Plating: Tin,Matte; Case Code (Imperial): 0603; Case Code (Metric): 1608; Min Operating Temperature: -55°C; Max Operating Temperature: 155°C; Packaging: Tape and Reel; Resistor Type: Thick Film; Termination: SMD/SMT; Length: 1.6mm; Height: 0.45mm; Depth: 0.8mm; Radiation Hardening: No; REACH SVHC: No SVHC; Lead Free: Lead Free; Military Standard: Not; ComponentLink1URL: https://datasheet.ciiva.com/11808/0900766b80f96399-11808081.pdf?src-supplier=RSComponents; ComponentLink1Description: https://datasheet.ciiva.com/11808/0900766b80f96399-11808081.pdf?src-supplier=RSComponents; ComponentLink2URL: https://datasheet.ciiva.com/25906/pyu-rc0603-51-rohs-l-4-25906933.pdf?src-supplier=Avnet+Europe; ComponentLink2Description: https://datasheet.ciiva.com/25906/pyu-rc0603-51-rohs-l-4-25906933.pdf?src-supplier=Avnet+Europe; ComponentLink3URL: https://datasheet.ciiva.com/7660/1868787-7660790.pdf?src-supplier=Element14; ComponentLink3Description: https://datasheet.ciiva.com/7660/1868787-7660790.pdf?src-supplier=Element14; ComponentLink4URL: https://datasheet.ciiva.com/7746/1738695-7746279.pdf?src-supplier=Element14; ComponentLink4Description: https://datasheet.ciiva.com/7746/1738695-7746279.pdf?src-supplier=Element14; ComponentLink5URL: https://datasheet.ciiva.com/7746/1686128-7746280.pdf?src-supplier=Element14; ComponentLink5Description: https://datasheet.ciiva.com/7746/1686128-7746280.pdf?src-supplier=Element14; ComponentLink6URL: https://datasheet.ciiva.com/28386/pyu-rc0603-51-rohs-l-4-28386648.pdf?src-supplier=Avnet+Europe; ComponentLink6Description: https://datasheet.ciiva.com/28386/pyu-rc0603-51-rohs-l-4-28386648.pdf?src-supplier=Avnet+Europe; ComponentLink7URL: https://datasheet.ciiva.com/7746/1738695-7746281.pdf?src-supplier=Element14; ComponentLink7Description: https://datasheet.ciiva.com/7746/1738695-7746281.pdf?src-supplier=Element14; ComponentLink8URL: https://datasheet.ciiva.com/8896/pyu-rc0603-51-rohs-l-4-8896106.pdf?src-supplier=Avnet; ComponentLink8Description: https://datasheet.ciiva.com/8896/pyu-rc0603-51-rohs-l-4-8896106.pdf?src-supplier=Avnet; ComponentLink9URL: https://datasheet.ciiva.com/15189/getdatasheetpartid-404327-15189644.pdf?src-supplier=Verical; ComponentLink9Description: https://datasheet.ciiva.com/15189/getdatasheetpartid-404327-15189644.pdf?src-supplier=Verical; ComponentLink10URL: https://datasheet.ciiva.com/7983/443971-7983613.pdf?src-supplier=Element14; ComponentLink10Description: https://datasheet.ciiva.com/7983/443971-7983613.pdf?src-supplier=Element14; Category: Resistor
R44 = RC0603FR-07220RL: 220 R, %1, 1/10W, 0603; Manufacturer: Yageo; Tolerance: 1%; Voltage Rating (DC): 50V; Temperature Coefficient: 100ppm/°C; Power Rating: 100mW; Supplier 1: Digi-Key; Supplier Part Number 1: 311-220HRCT-ND; Manufacturer Part Number: RC0603FR-07220RL; Stock 1: 3174401; Pricing 1: 1 = 0,10000, 10 = 0,02100, 100 = 0,00840, 1000 = 0,00379, 2500 = 0,00329 (USD); RoHS: Yes; Case/Package: 0603; Number of Pins: 2; Case Code (Imperial): 0603; Case Code (Metric): 1608; Min Operating Temperature: -55°C; Max Operating Temperature: 155°C; Resistance: 220R; Packaging: Tape and Reel; Resistor Type: Thick Film; Voltage Rating: 50V; Package Quantity: 1; Termination: SMD/SMT; Number of Terminations: 2; Max Power Dissipation: 100mW; Features: Moisture Resistant; Length: 1.6mm; Width: 0.031inch; Height: 0.022inch; Depth: 0.8mm; REACH SVHC: No SVHC; Lead Free: Lead Free; Military Standard: Not; ComponentLink1URL: https://datasheet.ciiva.com/2453/pyu-r-int-thick-7-2453973.pdf?src-supplier=Digi-Key; ComponentLink1Description: https://datasheet.ciiva.com/2453/pyu-r-int-thick-7-2453973.pdf?src-supplier=Digi-Key; ComponentLink2URL: https://datasheet.ciiva.com/2453/pyu-r-int-thick-7-2453974.pdf?src-supplier=Digi-Key; ComponentLink2Description: https://datasheet.ciiva.com/2453/pyu-r-int-thick-7-2453974.pdf?src-supplier=Digi-Key; ComponentLink3URL: https://datasheet.ciiva.com/2453/pyu-r-int-thick-7-2453975.pdf?src-supplier=Digi-Key; ComponentLink3Description: https://datasheet.ciiva.com/2453/pyu-r-int-thick-7-2453975.pdf?src-supplier=Digi-Key; ComponentLink4URL: https://datasheet.ciiva.com/7746/1738695-7746300.pdf?src-supplier=Element14; ComponentLink4Description: https://datasheet.ciiva.com/7746/1738695-7746300.pdf?src-supplier=Element14; ComponentLink5URL: https://datasheet.ciiva.com/7746/1738695-7746301.pdf?src-supplier=Element14; ComponentLink5Description: https://datasheet.ciiva.com/7746/1738695-7746301.pdf?src-supplier=Element14; Category: Resistor
R46 = RC0603FR-07100KL: 100K ,%1 ,1/10 W ,0603; Manufacturer: Yageo; Tolerance: 1%; Resistance: 100kR; Temperature Coefficient: 100ppm/°C; Voltage Rating (DC): 50V; Power Rating: 100mW; Working Voltage: 75V; Supplier 1: Digi-Key; Supplier Part Number 1: 311-100KHRCT-ND; Manufacturer Part Number: RC0603FR-07100KL; Stock 1: 10054915; Pricing 1: 1 = 0,10000, 10 = 0,02100, 100 = 0,00840, 1000 = 0,00379, 2500 = 0,00329 (USD); RoHS: Yes; Case/Package: 0603; Number of Pins: 2; Case Code (Imperial): 0603; Case Code (Metric): 1608; Min Operating Temperature: -55°C; Max Operating Temperature: 155°C; Packaging: Tape and Reel; Resistor Type: Thick Film; Voltage Rating: 50V; Termination: SMD/SMT; Number of Terminations: 2; Length: 1.6mm; Width: 0.8mm; Height: 0.45mm; Depth: 0.8mm; REACH SVHC: No SVHC; Lead Free: Lead Free; Military Standard: Not; ComponentLink1URL: https://datasheet.ciiva.com/11808/0900766b80f96399-11808107.pdf?src-supplier=RSComponents; ComponentLink1Description: https://datasheet.ciiva.com/11808/0900766b80f96399-11808107.pdf?src-supplier=RSComponents; ComponentLink2URL: https://datasheet.ciiva.com/7983/443971-7983593.pdf?src-supplier=Element14; ComponentLink2Description: https://datasheet.ciiva.com/7983/443971-7983593.pdf?src-supplier=Element14; ComponentLink3URL: https://datasheet.ciiva.com/46440/1868787-46440889.pdf?src-supplier=Element14; ComponentLink3Description: https://datasheet.ciiva.com/46440/1868787-46440889.pdf?src-supplier=Element14; ComponentLink4URL: https://datasheet.ciiva.com/7746/1738695-7746234.pdf?src-supplier=Element14; ComponentLink4Description: https://datasheet.ciiva.com/7746/1738695-7746234.pdf?src-supplier=Element14; ComponentLink5URL: https://datasheet.ciiva.com/7746/1738695-7746235.pdf?src-supplier=Element14; ComponentLink5Description: https://datasheet.ciiva.com/7746/1738695-7746235.pdf?src-supplier=Element14; ComponentLink6URL: https://datasheet.ciiva.com/22747/443971-22747516.pdf?src-supplier=Element14; ComponentLink6Description: https://datasheet.ciiva.com/22747/443971-22747516.pdf?src-supplier=Element14; Category: Resistor
SW1 SW2 = FSMRACDAH: Tactile Switches 6MM HGH TMP W/SQ ACT R/A TACT SWITCH; Manufacturer: TE Connectivity; Mechanical Life: 500000Cycles; Voltage Rating (DC): 24V; Throw Configuration: SPST; Contact Resistance: 100mR; Operating Force: 1.6N; Illumination Type: Illuminated; Current Rating: 50mA; Supplier 1: Digi-Key; Manufacturer Part Number: FSMRACDAH; Stock 1: 12268; Pricing 1: 1 = 0,25000, 10 = 0,23700, 25 = 0,22480, 100 = 0,20350, 250 = 0,18556, 500 = 0,17246, 1000 = 0,14713, 2500 = 0,14304, 5000 = 0,13487 (USD); RoHS: Yes; Mount: Through Hole,PCB; Contact Material: Silver; Color: Blue; Contact Plating: Silver; Min Operating Temperature: -35°C; Max Operating Temperature: 85°C; Package Quantity: 1000; Max Voltage Rating (DC): 24V; Termination: Solder; Electrical Life: 500000Cycles; Orientation: Right Angle; Series: FSM; Voltage Rating (AC): 24V; RoHS Compliant: Yes; REACH SVHC: No SVHC; ComponentLink1URL: https://www.alliedelec.com/m/d/d91cbe9e9b8a2a421b86c2a931ba0084.pdf?src-supplier=Allied+Electronics; ComponentLink1Description: https://www.alliedelec.com/m/d/d91cbe9e9b8a2a421b86c2a931ba0084.pdf?src-supplier=Allied+Electronics; ComponentLink2URL: http://www.mouser.com/ds/2/418/NG_CD_1825968_B-122456.pdf?src-supplier=Mouser; ComponentLink2Description: http://www.mouser.com/ds/2/418/NG_CD_1825968_B-122456.pdf?src-supplier=Mouser; ComponentLink3URL: http://www.onlinecomponents.com/productFiles/mf-AO/tyco-tactile.pdf?src-supplier=Onlinecomponents.com; ComponentLink3Description: http://www.onlinecomponents.com/productFiles/mf-AO/tyco-tactile.pdf?src-supplier=Onlinecomponents.com; ComponentLink4URL: http://www.farnell.com/datasheets/2074938.pdf?src-supplier=Element14; ComponentLink4Description: http://www.farnell.com/datasheets/2074938.pdf?src-supplier=Element14; Supplier Part Number 1: 450-1648-ND; Category: Switches - Tactile Switches
TP3-TP5 = TestPoint1: test ölçüm noktası; Category: TestPoint
TR3 = BC847,215: TRANS NPN 45V 0.1A SOT23; Manufacturer: Nexperia; Supplier 1: Digi-Key; Supplier Part Number 1: 1727-4855-1-ND; Manufacturer Part Number: BC847,215; Stock 1: 236151; Pricing 1: 1=0,14000, 10=0,12500, 100=0,06800, 500=0,04186, 1000=0,02854 (USD); RoHS: No; ComponentLink1URL: http://www.farnell.com/datasheets/1856333.pdf?src-supplier=Farnell; ComponentLink1Description: http://www.farnell.com/datasheets/1856333.pdf?src-supplier=Farnell; ComponentLink2URL: https://assets.nexperia.com/documents/data-sheet/BC847_SER.pdf?src-supplier=Digi-Key; ComponentLink2Description: https://assets.nexperia.com/documents/data-sheet/BC847_SER.pdf?src-supplier=Digi-Key; ComponentLink3URL: http://www.farnell.com/datasheets/1856333.pdf?src-supplier=Newark; ComponentLink3Description: http://www.farnell.com/datasheets/1856333.pdf?src-supplier=Newark; ComponentLink4URL: http://www.farnell.com/datasheets/1856333.pdf?src-supplier=Element14; ComponentLink4Description: http://www.farnell.com/datasheets/1856333.pdf?src-supplier=Element14; Category: Transistor-BJT
TVS5 TVS12 = 824014885: TVS DIODE 5V 10.5V DFN3810-9; Manufacturer: Wurth Electronics; Supplier 1: Digi-Key; Supplier Part Number 1: 732-11797-1-ND; Manufacturer Part Number: 824014885; Stock 1: 5123; Pricing 1: 1 = 1,19000, 10 = 1,08000, 100 = 0,97000, 500 = 0,85000, 1000 = 0,76000 (USD); RoHS: No; ComponentLink1URL: https://katalog.we-online.de/pbs/datasheet/824014885.pdf?src-supplier=Digi-Key; ComponentLink1Description: https://katalog.we-online.de/pbs/datasheet/824014885.pdf?src-supplier=Digi-Key; Category: Circuit Protection - TVS - Diodes
VR1 = LM1117MPX-3.3/NOPB: TEXAS INSTRUMENTS   LM1117MPX-3.3/NOPB.   LINEAR REG, FIX, 3.3V, 800MA, SOT-223-4, FULL REEL; Min Input Voltage: 2.6V; Max Input Voltage: 15V; Dropout Voltage: 1.2V; Number of Outputs: 1; Polarity: Positive; Quiescent Current: 10mA; Accuracy: 1%; Output Type: Fixed; Supplier 1: Digi-Key; Manufacturer: Texas Instruments; Manufacturer Part Number: LM1117MPX-3.3/NOPB; RoHS: Yes; Stock 1: 74620; Pricing 1: 1 = 1,14000, 10 = 1,01500, 100 = 0,79120, 500 = 0,65364, 1000 = 0,51603 (USD); Mount: Surface Mount; Case/Package: SOT-223; Number of Pins: 4; Contact Plating: Tin; Min Operating Temperature: -40°C; Max Operating Temperature: 125°C; Nominal Output Voltage: 3.3V; Output Current: 800mA; Packaging: Tape and Reel; Output Voltage: 3.3V; Max Output Current: 800mA; Current Rating: 800mA; Output Voltage Accuracy: 1%; Max Output Voltage: 3.3V; Length: 6.5mm; Height: 1.6mm; Width: 3.56mm; REACH SVHC: No SVHC; Lead Free: Lead Free; ComponentLink1URL: https://datasheet.ciiva.com/49027/1882372-49027926.pdf?src-supplier=Element14; ComponentLink1Description: https://datasheet.ciiva.com/49027/1882372-49027926.pdf?src-supplier=Element14; Category: Integrated Circuits (ICs) - PMIC - Voltage Reference; Supplier Part Number 1: LM1117MPX-3.3/NOPBCT-ND
XTAL1 = AB26T-32.768KHZ: CRYSTAL 32.7680KHZ 12.5PF T/H; Manufacturer: Abracon; Frequency Tolerance: 20ppm; ESR (Equivalent Series Resistance): 35kR; Frequency Stability: -0.034ppm; Supplier 1: Digi-Key; Supplier Part Number 1: 535-9032-ND; Manufacturer Part Number: AB26T-32.768KHZ; RoHS: Yes; Stock 1: 5808; Pricing 1: 1 = 0,21000, 10 = 0,17500, 50 = 0,15760, 100 = 0,14000, 500 = 0,13300, 1000 = 0,11200, 2500 = 0,10500, 5000 = 0,10150, 10000 = 0,09800 (USD); Mount: Through Hole; Case/Package: Radial; Min Operating Temperature: -10°C; Max Operating Temperature: 60°C; Frequency: 32.768kHz; Packaging: Bulk; Package Quantity: 500; Load Capacitance: 12.5pF; Termination: Radial; Tolerance: 20ppm; Series Resistance: 35kR; Length: 2.1mm; Height: 0.244inch; Lead Pitch: 0.8mm; REACH SVHC: Unknown; Lead Free: Lead Free; ComponentLink1URL: https://datasheet.ciiva.com/3174/ab26t-3174133.pdf?src-supplier=Avnet; ComponentLink1Description: https://datasheet.ciiva.com/3174/ab26t-3174133.pdf?src-supplier=Avnet; ComponentLink2URL: https://datasheet.ciiva.com/16506/ab26t-16506517.pdf?src-supplier=Future+Electronics; ComponentLink2Description: https://datasheet.ciiva.com/16506/ab26t-16506517.pdf?src-supplier=Future+Electronics; ComponentLink3URL: https://datasheet.ciiva.com/15223/getdatasheetpartid-720060-15223238.pdf?src-supplier=Verical; ComponentLink3Description: https://datasheet.ciiva.com/15223/getdatasheetpartid-720060-15223238.pdf?src-supplier=Verical; ComponentLink4URL: https://datasheet.ciiva.com/854/ab26t-854460.pdf?src-supplier=Digi-Key; ComponentLink4Description: https://datasheet.ciiva.com/854/ab26t-854460.pdf?src-supplier=Digi-Key; Category: Crystals